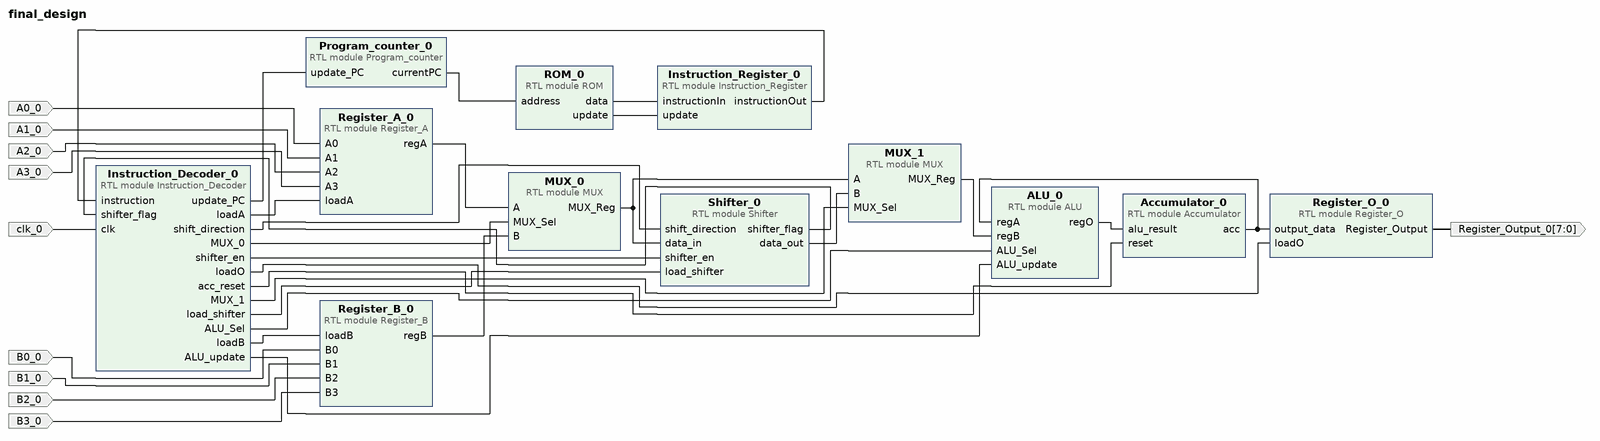
[diagram p0: block diagram of the top level]
# Vivado block design final_design, xc7a100tcsg324-1, Vivado 2019.2
create_bd_design final_design

create_bd_port -dir I A0_0
create_bd_port -dir I A1_0
create_bd_port -dir I A2_0
create_bd_port -dir I A3_0
create_bd_port -dir I B0_0
create_bd_port -dir I B1_0
create_bd_port -dir I B2_0
create_bd_port -dir I B3_0
create_bd_port -dir I -type clk clk_0
create_bd_port -dir O -from 7 -to 0 Register_Output_0

create_bd_cell -type module -reference Instruction_Register Instruction_Register_0
create_bd_cell -type module -reference Program_counter Program_counter_0
create_bd_cell -type module -reference Register_O Register_O_0
create_bd_cell -type module -reference Shifter Shifter_0
create_bd_cell -type module -reference MUX MUX_0
create_bd_cell -type module -reference MUX MUX_1
create_bd_cell -type module -reference Instruction_Decoder Instruction_Decoder_0
create_bd_cell -type module -reference Register_A Register_A_0
create_bd_cell -type module -reference Register_B Register_B_0
create_bd_cell -type module -reference ROM ROM_0
create_bd_cell -type module -reference ALU ALU_0
create_bd_cell -type module -reference Accumulator Accumulator_0

# ---- connections ----

connect_bd_net [get_bd_pins Instruction_Decoder_0/loadA] [get_bd_pins Register_A_0/loadA]
connect_bd_net [get_bd_pins Instruction_Decoder_0/loadB] [get_bd_pins Register_B_0/loadB]
connect_bd_net [get_bd_pins Instruction_Decoder_0/loadO] [get_bd_pins Register_O_0/loadO]
connect_bd_net [get_bd_pins Register_B_0/regB] [get_bd_pins MUX_0/B]
connect_bd_net [get_bd_pins Shifter_0/data_out] [get_bd_pins MUX_1/B]
connect_bd_net [get_bd_pins Instruction_Decoder_0/acc_reset] [get_bd_pins Accumulator_0/reset]
connect_bd_net -net A0_0_1 [get_bd_ports A0_0] [get_bd_pins Register_A_0/A0]
connect_bd_net -net A1_0_1 [get_bd_ports A1_0] [get_bd_pins Register_A_0/A1]
connect_bd_net -net A2_0_1 [get_bd_ports A2_0] [get_bd_pins Register_A_0/A2]
connect_bd_net -net A3_0_1 [get_bd_ports A3_0] [get_bd_pins Register_A_0/A3]
connect_bd_net -net B0_0_1 [get_bd_ports B0_0] [get_bd_pins Register_B_0/B0]
connect_bd_net -net B1_0_1 [get_bd_ports B1_0] [get_bd_pins Register_B_0/B1]
connect_bd_net -net B2_0_1 [get_bd_ports B2_0] [get_bd_pins Register_B_0/B2]
connect_bd_net -net B3_0_1 [get_bd_ports B3_0] [get_bd_pins Register_B_0/B3]
connect_bd_net [get_bd_pins Instruction_Decoder_0/MUX_0] [get_bd_pins MUX_0/MUX_Sel]
connect_bd_net [get_bd_pins Instruction_Decoder_0/MUX_1] [get_bd_pins MUX_1/MUX_Sel]
connect_bd_net [get_bd_pins Instruction_Decoder_0/shift_direction] [get_bd_pins Shifter_0/shift_direction]
connect_bd_net [get_bd_pins Instruction_Decoder_0/shifter_en] [get_bd_pins Shifter_0/shifter_en]
connect_bd_net [get_bd_pins Instruction_Decoder_0/ALU_Sel] [get_bd_pins ALU_0/ALU_Sel]
connect_bd_net [get_bd_pins Instruction_Decoder_0/load_shifter] [get_bd_pins Shifter_0/load_shifter]
connect_bd_net [get_bd_pins ROM_0/data] [get_bd_pins Instruction_Register_0/instructionIn]
connect_bd_net [get_bd_pins Program_counter_0/currentPC] [get_bd_pins ROM_0/address]
connect_bd_net [get_bd_pins Instruction_Register_0/instructionOut] [get_bd_pins Instruction_Decoder_0/instruction]
connect_bd_net -net clk_0_1 [get_bd_ports clk_0] [get_bd_pins Instruction_Decoder_0/clk]
connect_bd_net [get_bd_pins ROM_0/update] [get_bd_pins Instruction_Register_0/update]
connect_bd_net [get_bd_pins Register_A_0/regA] [get_bd_pins MUX_0/A]
connect_bd_net [get_bd_pins MUX_0/MUX_Reg] [get_bd_pins Shifter_0/data_in] [get_bd_pins MUX_1/A]
connect_bd_net [get_bd_pins Instruction_Decoder_0/update_PC] [get_bd_pins Program_counter_0/update_PC]
connect_bd_net [get_bd_pins MUX_1/MUX_Reg] [get_bd_pins ALU_0/regB]
connect_bd_net [get_bd_pins Register_O_0/Register_Output] [get_bd_ports Register_Output_0]
connect_bd_net [get_bd_pins Shifter_0/shifter_flag] [get_bd_pins Instruction_Decoder_0/shifter_flag]
connect_bd_net [get_bd_pins ALU_0/regO] [get_bd_pins Accumulator_0/alu_result]
connect_bd_net [get_bd_pins Accumulator_0/acc] [get_bd_pins Register_O_0/output_data] [get_bd_pins ALU_0/regA]
connect_bd_net -net MUX_1_ALU_update_out [get_bd_pins Instruction_Decoder_0/ALU_update] [get_bd_pins ALU_0/ALU_update]

validate_bd_design
save_bd_design
